# Altium project IceZUM_Core_HX1K.PrjPcb (part 2 of 2)
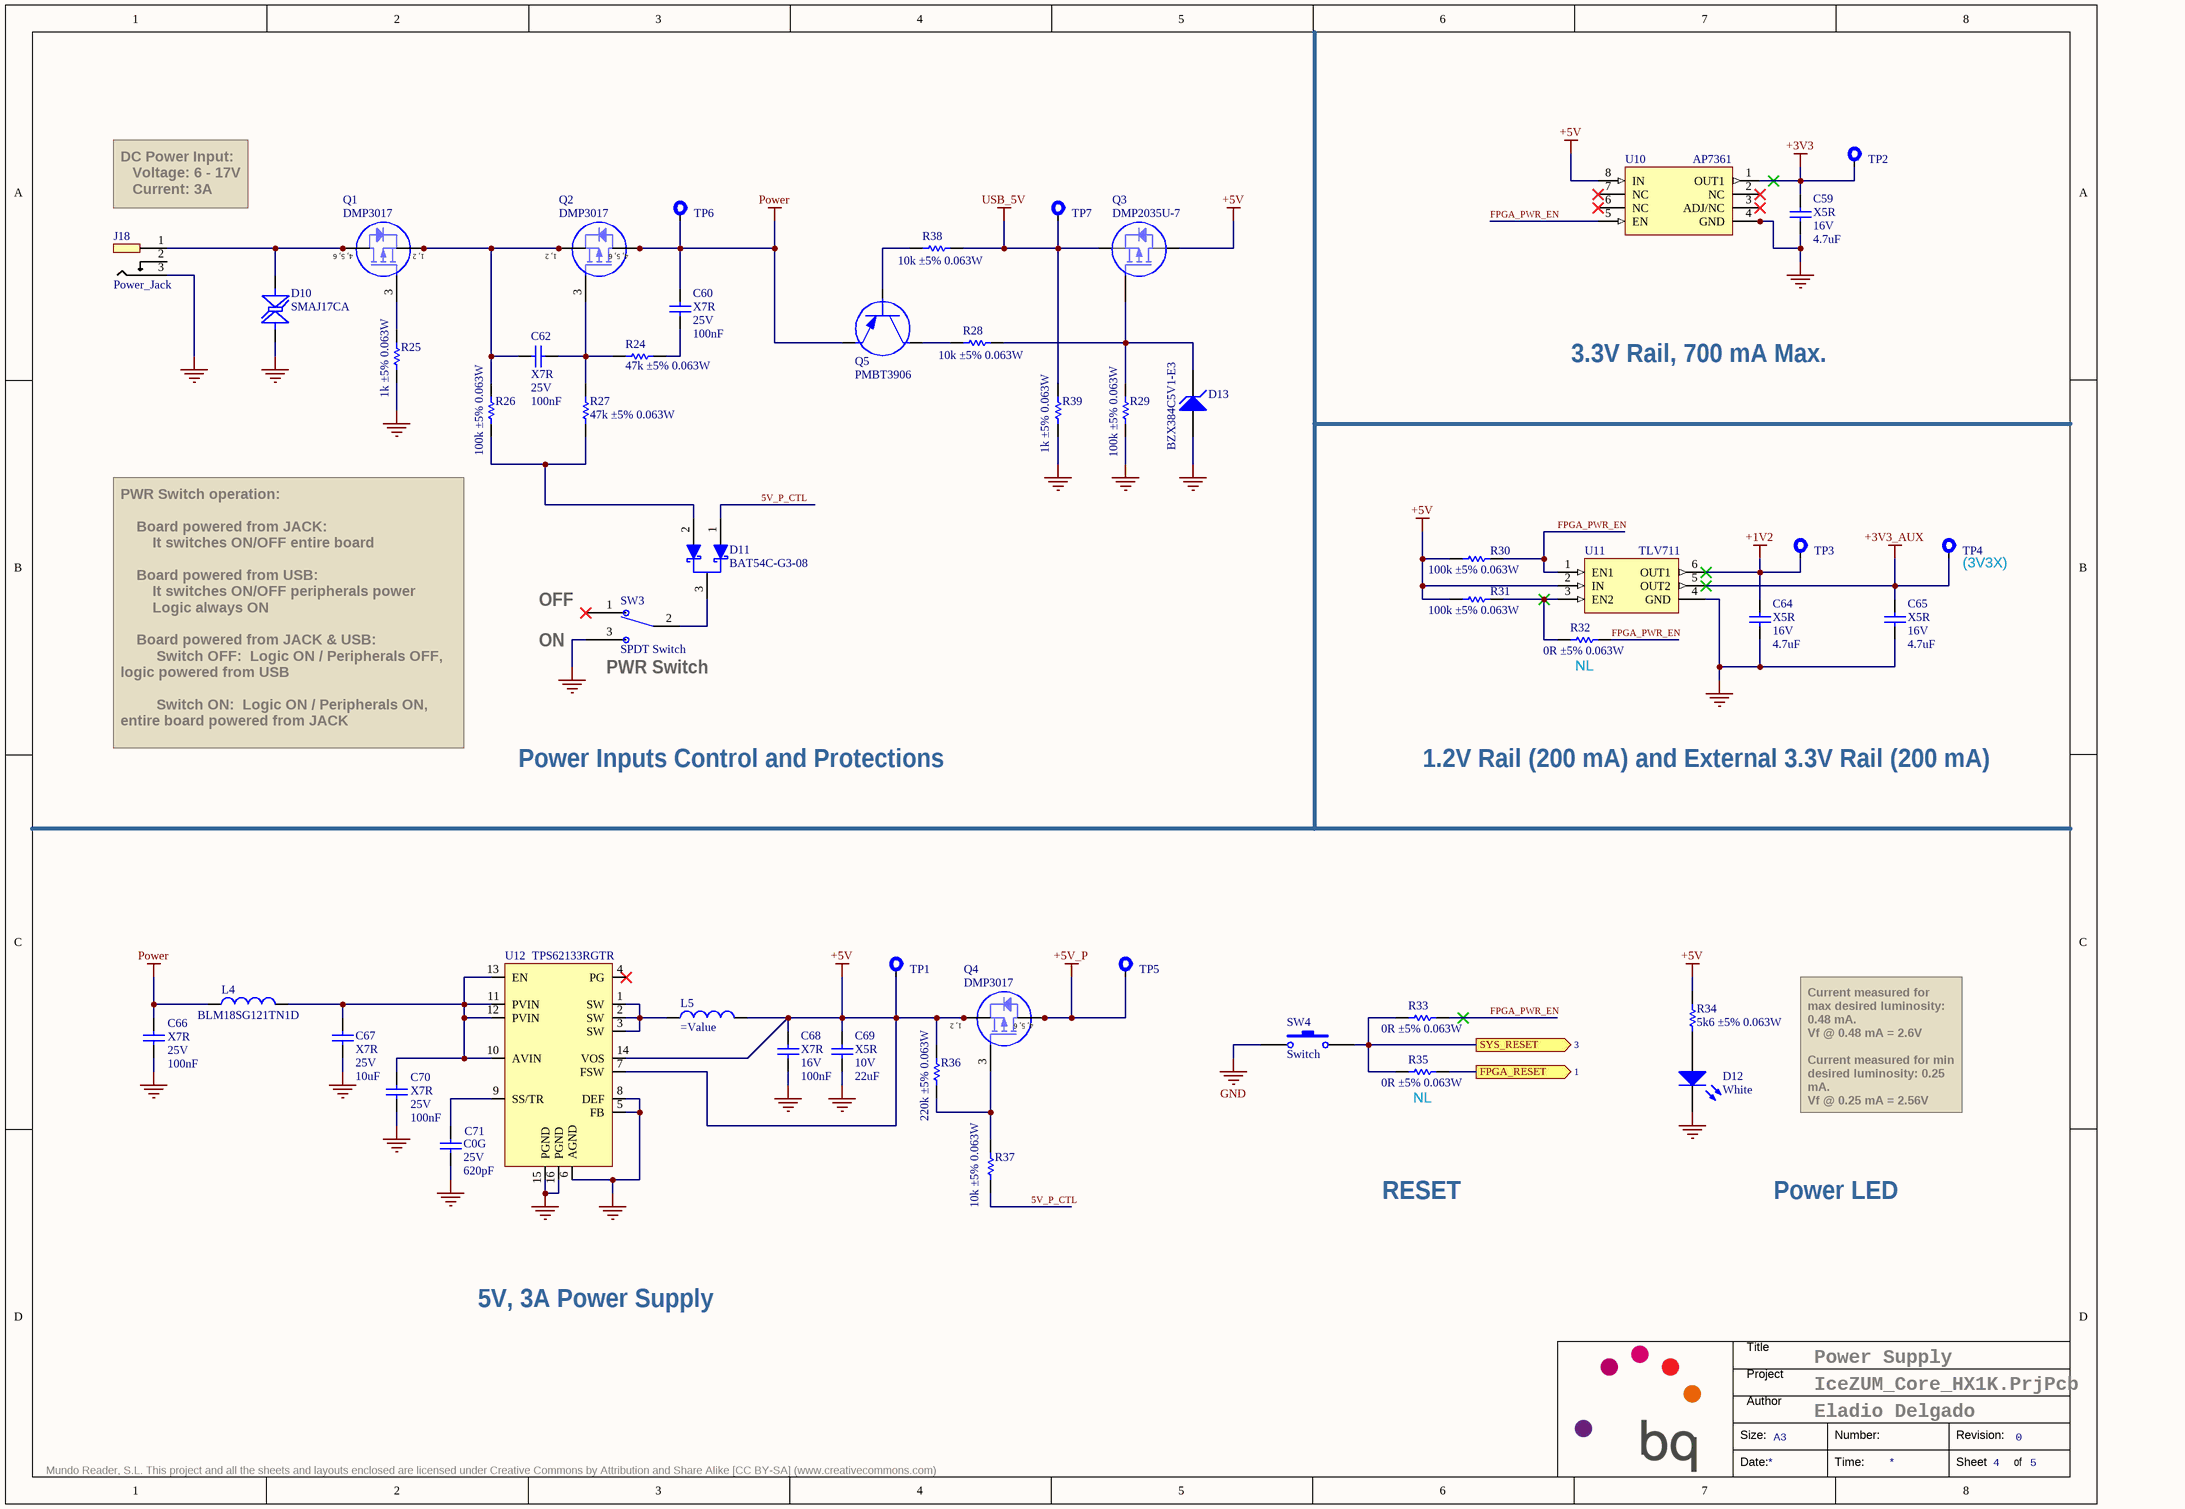
[diagram p5: [4]_Power_Supply.SchDoc]

## Nets that join several sheets
+1V2: [1]_FPGA (9 pins), [4]_Power_Supply (C64.2 TP3.1 U11.6)
+3V3: [1]_FPGA (27 pins), [2]_USB_Interface (22 pins), [3]_Connectors_&_IO (14 pins), [4]_Power_Supply (C59.2 TP2.1 U10.1)
+3V3_AUX: [3]_Connectors_&_IO (J5.4), [4]_Power_Supply (C65.2 TP4.1 U11.5)
+5V: [3]_Connectors_&_IO (10 pins), [4]_Power_Supply (15 pins)
+5V_P: [3]_Connectors_&_IO (25 pins), [4]_Power_Supply (Q4.4 Q4.5 Q4.6 TP5.1)
GND: [1]_FPGA (25 pins), [2]_USB_Interface (39 pins), [3]_Connectors_&_IO (71 pins), [4]_Power_Supply (26 pins)
Power: [3]_Connectors_&_IO (J5.8), [4]_Power_Supply (8 pins)
USB_5V: [2]_USB_Interface (F1.2), [4]_Power_Supply (Q3.2 R38.2 R39.2 TP7.1)
GPIO_L0: [1]_FPGA (R6.1 U1.71 U2.1), [2]_USB_Interface (U3.21)
GPIO_L2: [1]_FPGA (R1.2 U1.65), [2]_USB_Interface (U3.23)
GPIO_L3: [1]_FPGA (R2.1), [2]_USB_Interface (U3.24)
NetC34_2: [1]_FPGA (U1.10), [3]_Connectors_&_IO (C34.2 SW1.1)
NetC35_2: [1]_FPGA (U1.11), [3]_Connectors_&_IO (C35.2 SW2.1)
NetJ5_3: [3]_Connectors_&_IO (J5.3), [4]_Power_Supply (R33.1 R35.1 SW4.1)
NetJ19_1: [1]_FPGA (U1.37), [3]_Connectors_&_IO (J19.1)
NetJ19_2: [1]_FPGA (U1.38), [3]_Connectors_&_IO (J19.2)
NetJ19_3: [1]_FPGA (U1.39), [3]_Connectors_&_IO (J19.3)
NetJ19_4: [1]_FPGA (U1.41), [3]_Connectors_&_IO (J19.4)
NetJ19_5: [1]_FPGA (U1.42), [3]_Connectors_&_IO (J19.5)
NetJ19_6: [1]_FPGA (U1.43), [3]_Connectors_&_IO (J19.6)
NetJ19_7: [1]_FPGA (U1.49), [3]_Connectors_&_IO (J19.7)
NetJ19_8: [1]_FPGA (U1.50), [3]_Connectors_&_IO (J19.8)
NetR2_2: [1]_FPGA (R2.2 R3.2 U1.66), [4]_Power_Supply (R35.2)
NetR16_2: [1]_FPGA (U1.21), [2]_USB_Interface (R16.2)
NetR17_1: [1]_FPGA (U1.95), [3]_Connectors_&_IO (R17.1)
NetR17_2: [1]_FPGA (U1.96), [3]_Connectors_&_IO (R17.2)
NetR17_3: [1]_FPGA (U1.97), [3]_Connectors_&_IO (R17.3)
NetR17_4: [1]_FPGA (U1.98), [3]_Connectors_&_IO (R17.4)
NetR18_1: [1]_FPGA (U1.99), [3]_Connectors_&_IO (R18.1)
NetR18_2: [1]_FPGA (U1.101), [3]_Connectors_&_IO (R18.2)
NetR18_3: [1]_FPGA (U1.102), [3]_Connectors_&_IO (R18.3)
NetR18_4: [1]_FPGA (U1.104), [3]_Connectors_&_IO (R18.4)
NetR20_1: [1]_FPGA (U1.91), [3]_Connectors_&_IO (R20.1 U7.3)
NetR21_1: [1]_FPGA (U1.90), [3]_Connectors_&_IO (R21.1 U7.4)
NetU1_1: [1]_FPGA (U1.1), [2]_USB_Interface (U3.45)
NetU1_2: [1]_FPGA (U1.2), [2]_USB_Interface (U3.44)
NetU1_3: [1]_FPGA (U1.3), [2]_USB_Interface (U3.43)
NetU1_4: [1]_FPGA (U1.4), [2]_USB_Interface (U3.41)
NetU1_7: [1]_FPGA (U1.7), [2]_USB_Interface (U3.40)
NetU1_8: [1]_FPGA (U1.8), [2]_USB_Interface (U3.39)
NetU1_9: [1]_FPGA (U1.9), [2]_USB_Interface (U3.38)
NetU1_78: [1]_FPGA (U1.78), [3]_Connectors_&_IO (U8.9)
NetU1_79: [1]_FPGA (U1.79), [3]_Connectors_&_IO (U8.8)
NetU1_80: [1]_FPGA (U1.80), [3]_Connectors_&_IO (U8.7)
NetU1_81: [1]_FPGA (U1.81), [3]_Connectors_&_IO (U8.6)
NetU1_87: [1]_FPGA (U1.87), [3]_Connectors_&_IO (U8.4)
NetU1_88: [1]_FPGA (U1.88), [3]_Connectors_&_IO (U8.5)
NetU1_93: [1]_FPGA (U1.93), [3]_Connectors_&_IO (U7.2)
NetU1_112: [1]_FPGA (U1.112), [3]_Connectors_&_IO (U9.1)
NetU1_113: [1]_FPGA (U1.113), [3]_Connectors_&_IO (U9.3)
NetU1_114: [1]_FPGA (U1.114), [3]_Connectors_&_IO (U9.4)
NetU1_115: [1]_FPGA (U1.115), [3]_Connectors_&_IO (U9.5)
NetU1_116: [1]_FPGA (U1.116), [3]_Connectors_&_IO (U9.6)
NetU1_117: [1]_FPGA (U1.117), [3]_Connectors_&_IO (U9.7)
NetU1_118: [1]_FPGA (U1.118), [3]_Connectors_&_IO (U9.8)
NetU1_119: [1]_FPGA (U1.119), [3]_Connectors_&_IO (U9.9)
NetU1_138: [1]_FPGA (U1.138), [3]_Connectors_&_IO (U6.7)
NetU1_139: [1]_FPGA (U1.139), [3]_Connectors_&_IO (U6.6)
NetU1_141: [1]_FPGA (U1.141), [3]_Connectors_&_IO (U6.5)
NetU1_142: [1]_FPGA (U1.142), [3]_Connectors_&_IO (U6.4)
NetU1_143: [1]_FPGA (U1.143), [3]_Connectors_&_IO (U6.3)
NetU1_144: [1]_FPGA (U1.144), [3]_Connectors_&_IO (U6.1)
SPI_DI: [1]_FPGA (U1.68 U2.2), [2]_USB_Interface (U3.18)
SPI_DO: [1]_FPGA (U1.67 U2.5), [2]_USB_Interface (U3.17)
SPI_SK: [1]_FPGA (R5.1 U1.70 U2.6), [2]_USB_Interface (U3.16)